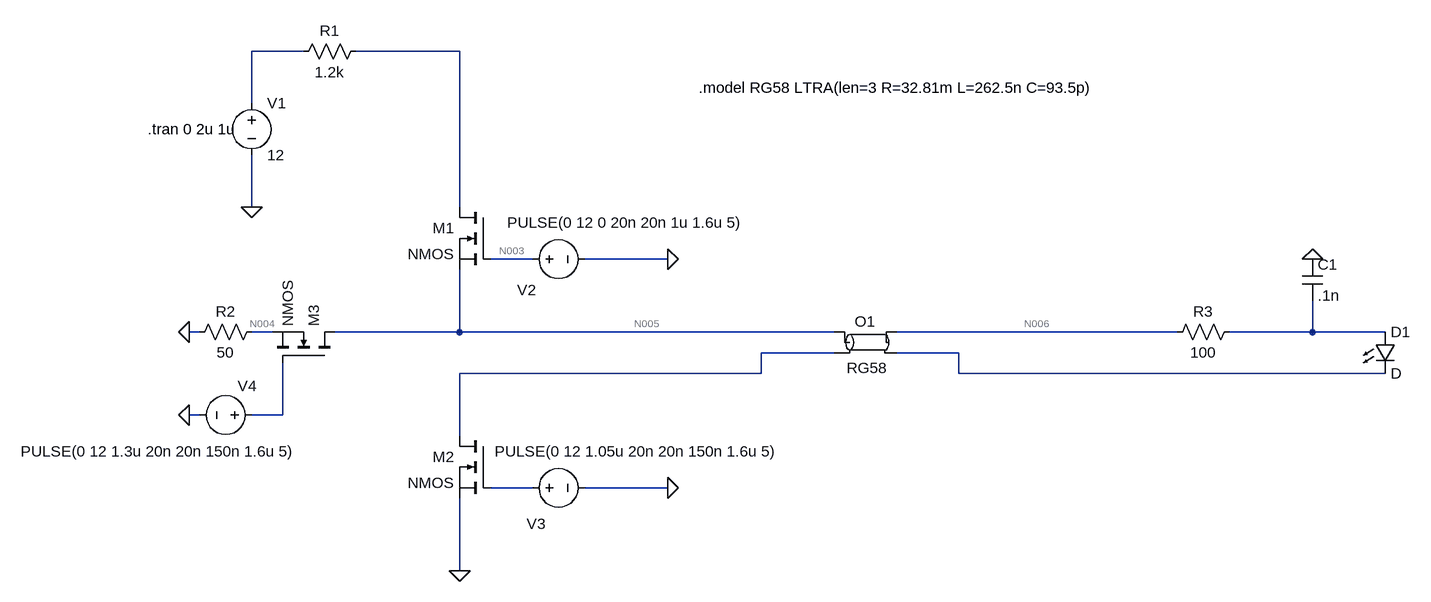
[diagram p0: schematic LEDpulser4_with_RG58.asc]
LEDpulser4_with_RG58.asc, the LTspice schematic file:
Version 4
SHEET 1 1732 1268
WIRE -768 64 -848 64
WIRE -528 64 -688 64
WIRE -848 144 -848 64
WIRE -848 304 -848 224
WIRE -528 304 -528 64
WIRE -416 384 -480 384
WIRE -208 384 -336 384
WIRE -928 496 -944 496
WIRE -816 496 -848 496
WIRE -528 496 -528 400
WIRE -528 496 -720 496
WIRE 48 496 -528 496
WIRE 576 496 144 496
WIRE 784 496 784 448
WIRE 784 496 656 496
WIRE 896 496 784 496
WIRE 48 528 -64 528
WIRE 240 528 144 528
WIRE -64 560 -64 528
WIRE -64 560 -528 560
WIRE 240 560 240 528
WIRE 896 560 240 560
WIRE -928 624 -944 624
WIRE -800 624 -800 544
WIRE -800 624 -848 624
WIRE -528 656 -528 560
WIRE -416 736 -480 736
WIRE -208 736 -336 736
WIRE -528 864 -528 752
FLAG -208 384 0
FLAG -848 304 0
FLAG -208 736 0
FLAG -944 624 0
FLAG -944 496 0
FLAG 784 384 0
FLAG -528 864 0
SYMBOL voltage -848 128 R0
WINDOW 123 0 0 Left 0
WINDOW 39 0 0 Left 0
SYMATTR InstName V1
SYMATTR Value 12
SYMBOL voltage -432 384 R270
WINDOW 0 -63 7 VTop 2
WINDOW 3 72 159 VBottom 2
WINDOW 123 0 0 Left 0
WINDOW 39 0 0 Left 0
SYMATTR InstName V2
SYMATTR Value PULSE(0 12 0 20n 20n 1u 1.6u 5)
SYMBOL nmos -480 304 M0
SYMATTR InstName M1
SYMBOL res -672 48 R90
WINDOW 0 0 56 VBottom 2
WINDOW 3 32 56 VTop 2
SYMATTR InstName R1
SYMATTR Value 1.2k
SYMBOL nmos -480 656 M0
SYMATTR InstName M2
SYMBOL voltage -432 736 R270
WINDOW 0 -55 7 VRight 2
WINDOW 3 56 -42 VRight 2
WINDOW 123 0 0 Left 0
WINDOW 39 0 0 Left 0
SYMATTR InstName V3
SYMATTR Value PULSE(0 12 1.05u 20n 20n 150n 1.6u 5)
SYMBOL nmos -720 544 M270
SYMATTR InstName M3
SYMBOL res -944 512 R270
WINDOW 0 32 56 VTop 2
WINDOW 3 0 56 VBottom 2
SYMATTR InstName R2
SYMATTR Value 50
SYMBOL voltage -832 624 R90
WINDOW 0 -45 8 VRight 2
WINDOW 3 56 -54 VRight 2
WINDOW 123 0 0 Left 0
WINDOW 39 0 0 Left 0
SYMATTR InstName V4
SYMATTR Value PULSE(0 12 1.3u 20n 20n 150n 1.6u 5)
SYMBOL LED 880 496 R0
SYMATTR InstName D1
SYMBOL cap 768 384 R0
SYMATTR InstName C1
SYMATTR Value .1n
SYMBOL res 672 480 R90
WINDOW 0 0 56 VBottom 2
WINDOW 3 32 56 VTop 2
SYMATTR InstName R3
SYMATTR Value 100
SYMBOL ltline 96 512 R0
WINDOW 3 3 24 Top 2
SYMATTR Value RG58
SYMATTR InstName O1
TEXT -1008 184 Left 2 !.tran 0 2u 1u
TEXT -160 120 Left 2 !.model RG58 LTRA(len=3 R=32.81m L=262.5n C=93.5p)

The netlist it stands for:
* LEDpulser4_with_RG58.asc
V1 N001 0 12
V2 N003 0 PULSE(0 12 0 20n 20n 1u 1.6u 5)
M1 N002 N003 N005 N005 NMOS
R1 N002 N001 1.2k
M2 N008 N011 0 0 NMOS
V3 N011 0 PULSE(0 12 1.05u 20n 20n 150n 1.6u 5)
M3 N005 N010 N004 N004 NMOS
R2 0 N004 50
V4 N010 0 PULSE(0 12 1.3u 20n 20n 150n 1.6u 5)
D1 N007 N009 D
C1 0 N007 .1n
R3 N007 N006 100
O1 N005 N008 N006 N009 RG58
.model D D
.lib standard.dio
.model NMOS NMOS
.model PMOS PMOS
.lib standard.mos
.tran 0 2u 1u
.model RG58 LTRA(len=3 R=32.81m L=262.5n C=93.5p)
.backanno
.end

* Results of the author's LTspice run, read from the files saved beside the schematic
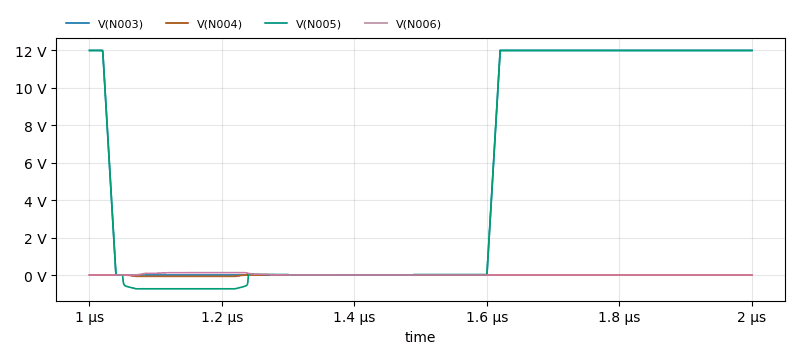
[diagram p1: Transient Analysis of LEDpulser4_with_RG58.asc, plotted from the saved traces]
* Transient Analysis, 1 run:
*   V(N003): min 0 V, max 12 V, average 5.04 V, rms 7.775 V, last 12 V
*   V(N004): min -71.4 mV, max 0 V, average -11.67 mV, rms 28.38 mV, last 0 V
*   V(N005): min -735.6 mV, max 12 V, average 4.905 V, rms 7.774 V, last 11.99 V
*   V(N006): min 0 V, max 129.9 mV, average 21.24 mV, rms 49.14 mV, last 0 V